# EAGLE design msp430f5528 (EAGLE 5.11)
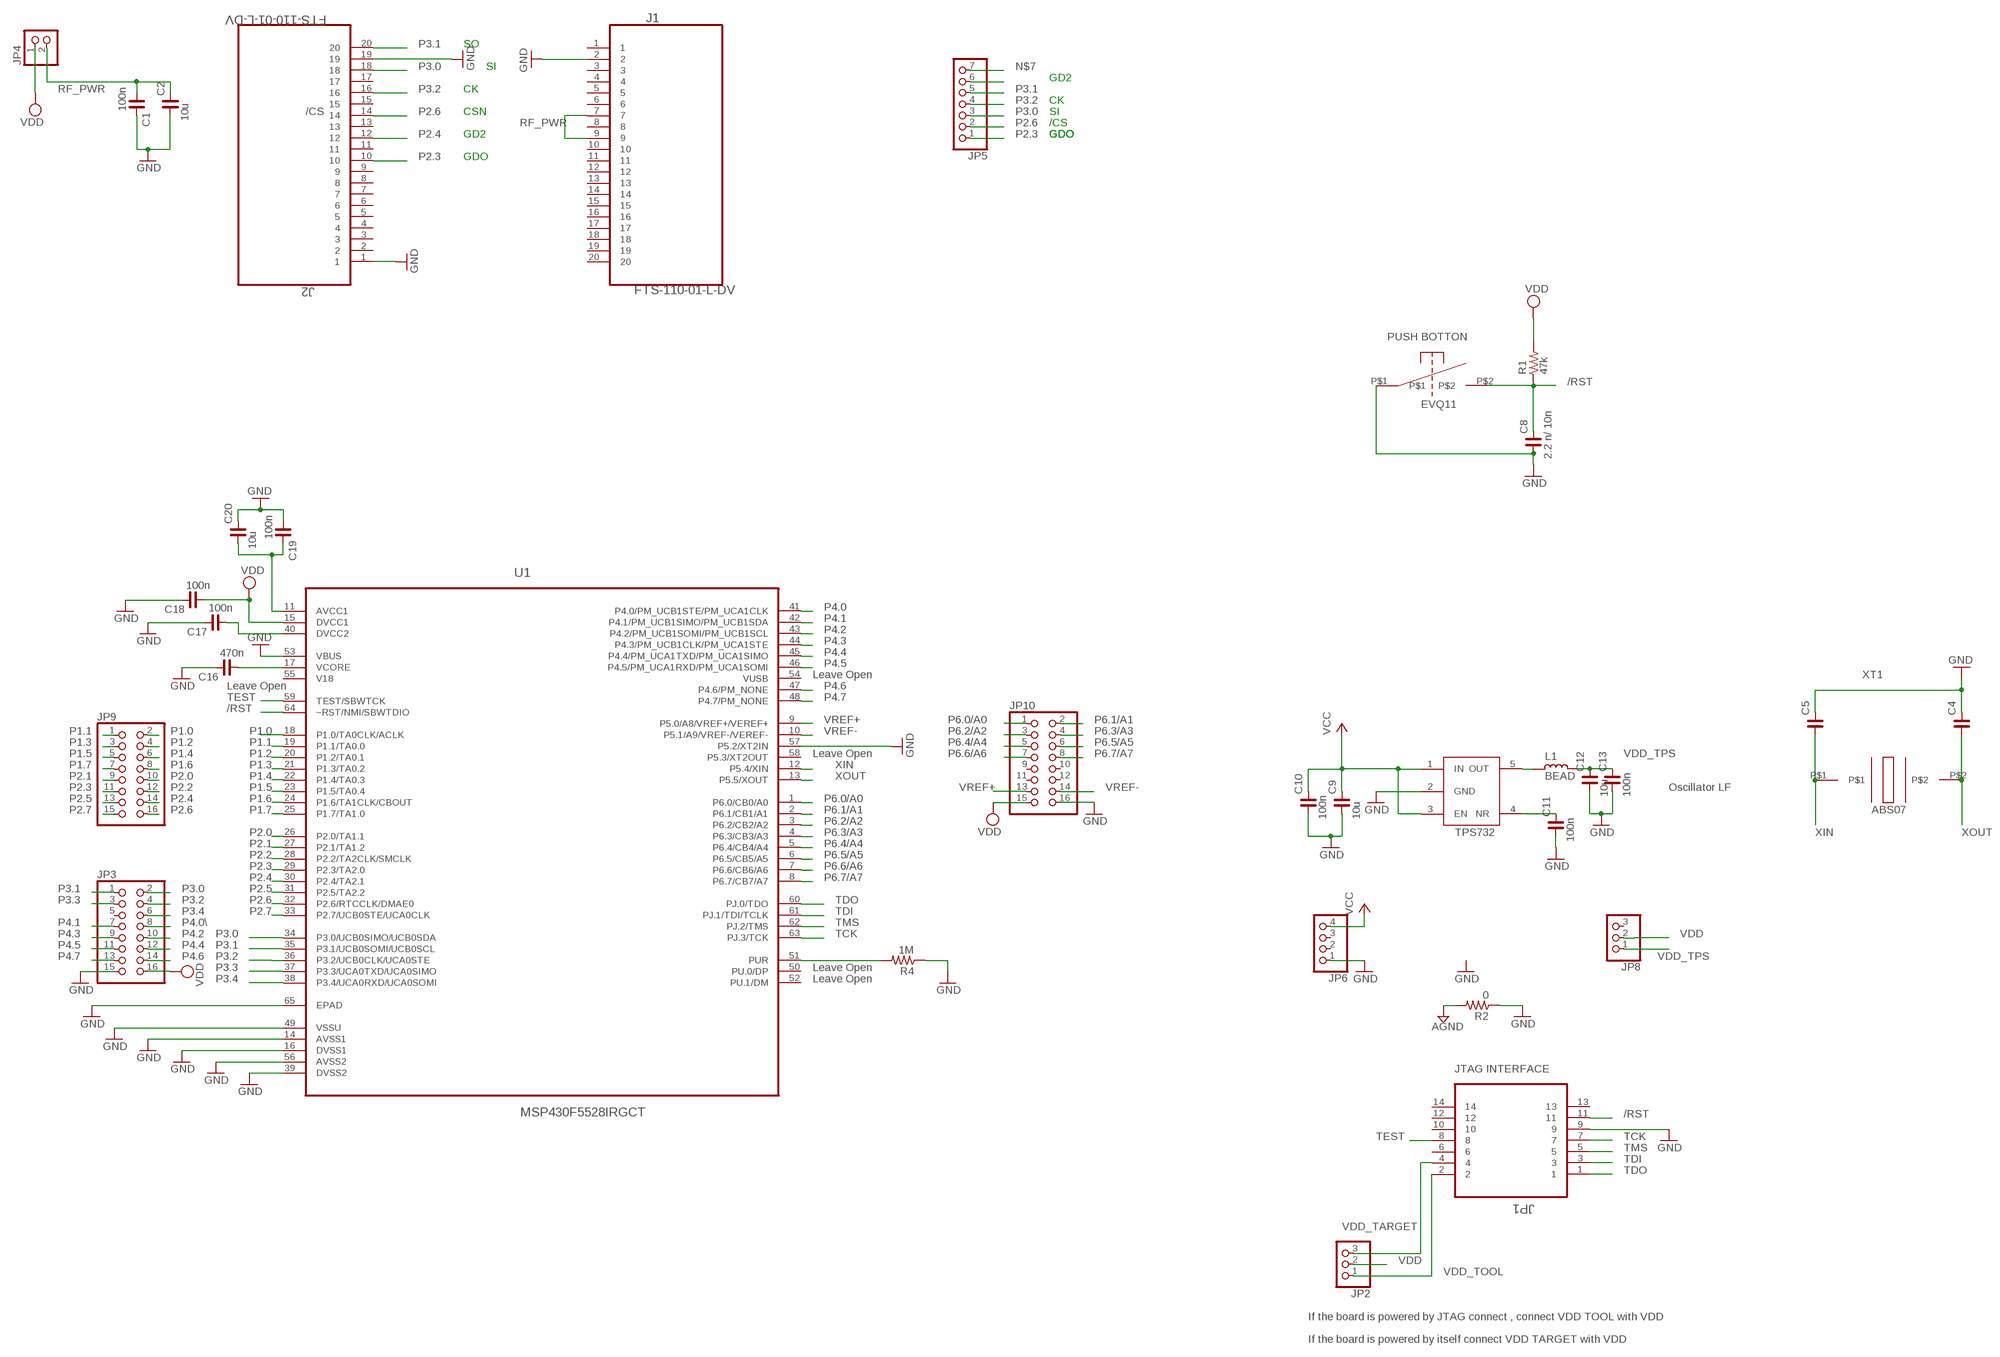
[diagram p0: schematic, sheet 1]

## Parts
C1  100n  C_0402  [C0402]
C2  10u  C_0402  [C0402]
C4  C_0402  [C0402]
C5  C_0402  [C0402]
C8  2.2 n/ 10n  C_0402  [C0402]
C9  10u  C_0402  [C0402]
C10  100n  C_0402  [C0402]
C11  100n  C_0402  [C0402]
C12  10u  C_0402  [C0402]
C13  100n  C_0402  [C0402]
C16  470n  C_0402  [C0402]
C17  100n  C_0402  [C0402]
C18  100n  C_0402  [C0402]
C19  100n  C_0402  [C0402]
C20  10u  C_0402  [C0402]
J1  FTS-110-01-L-DV  [SAMTEC_FTS-110-01-L-DV]
J2  FTS-110-01-L-DV  [SAMTEC_FTS-110-01-L-DV]
JP1  5103308-2  [TYCO_5103308-2]
JP2  PINHD-1X3  [1X03]
JP3  PINHD-2X8  [2X08]
JP4  PINHD-1X2  [1X02]
JP5  PINHD-1X7  [1X07]
JP6  PINHD-1X4  [1X04]
JP8  PINHD-1X3  [1X03]
JP9  PINHD-2X8  [2X08]
JP10  PINHD-2X8  [2X08]
L1  BEAD  L_0402  [L0402]
R1  47k  R_0402  [R0402]
R2  0  R_0402  [R0402]
R4  1M  R_0201  [R0201]
TPS7323  TPS732XX  [SOT23]
U1  MSP430F5528IRGCT  [QFN50P900X900X100-65N]
U$2  OSC32K  [ABS07]
U$4  PUSH_BOT  [EVQ_11_TH]

## Nets
/RST: C8.2 JP1.11 R1.1 U1.64(~RST/NMI/SBWTDIO) U$4.P$2
AGND: R2.2
GND: C1.2 C2.1 C4.2 C5.2 C8.1 C9.1 C10.1 C11.1 C12.1 C13.1 C16.2 C17.2 C18.2 C19.1 C20.2 J1.2 J2.1 J2.19 JP1.9 JP3.15 JP6.1 JP10.16 R2.1 R4.1 TPS7323.2(GND) U1.14(AVSS1) U1.16(DVSS1) U1.39(DVSS2) U1.49(VSSU) U1.53(VBUS) U1.56(AVSS2) U1.57(P5.2/XT2IN) U1.65(EPAD) U$4.P$1
N$6: C16.1 U1.17(VCORE)
N$7: JP5.7
N$8: R4.2 U1.51(PUR)
N$47: C11.2 TPS7323.4(NR)
N$48: L1.2 TPS7323.5(OUT)
P1.0: JP9.2 U1.18(P1.0/TA0CLK/ACLK)
P1.1: JP9.1 U1.19(P1.1/TA0.0)
P1.2: JP9.4 U1.20(P1.2/TA0.1)
P1.3: JP9.3 U1.21(P1.3/TA0.2)
P1.4: JP9.6 U1.22(P1.4/TA0.3)
P1.5: JP9.5 U1.23(P1.5/TA0.4)
P1.6: JP9.8 U1.24(P1.6/TA1CLK/CBOUT)
P1.7: JP9.7 U1.25(P1.7/TA1.0)
P2.0: JP9.10 U1.26(P2.0/TA1.1)
P2.1: JP9.9 U1.27(P2.1/TA1.2)
P2.2: JP9.12 U1.28(P2.2/TA2CLK/SMCLK)
P2.3: J2.10 JP5.1 JP9.11 U1.29(P2.3/TA2.0)
P2.4: J2.12 JP5.6 JP9.14 U1.30(P2.4/TA2.1)
P2.5: JP9.13 U1.31(P2.5/TA2.2)
P2.6: J2.14 JP5.2 JP9.16 U1.32(P2.6/RTCCLK/DMAE0)
P2.7: JP9.15 U1.33(P2.7/UCB0STE/UCA0CLK)
P3.0: J2.18 JP3.2 JP5.3 U1.34(P3.0/UCB0SIMO/UCB0SDA)
P3.1: J2.20 JP3.1 JP5.5 U1.35(P3.1/UCB0SOMI/UCB0SCL)
P3.2: J2.16 JP3.4 JP5.4 U1.36(P3.2/UCB0CLK/UCA0STE)
P3.3: JP3.3 U1.37(P3.3/UCA0TXD/UCA0SIMO)
P3.4: JP3.6 U1.38(P3.4/UCA0RXD/UCA0SOMI)
P4.0: U1.41(P4.0/PM_UCB1STE/PM_UCA1CLK)
P4.0\: JP3.8
P4.1: JP3.7 U1.42(P4.1/PM_UCB1SIMO/PM_UCB1SDA)
P4.2: JP3.10 U1.43(P4.2/PM_UCB1SOMI/PM_UCB1SCL)
P4.3: JP3.9 U1.44(P4.3/PM_UCB1CLK/PM_UCA1STE)
P4.4: JP3.12 U1.45(P4.4/PM_UCA1TXD/PM_UCA1SIMO)
P4.5: JP3.11 U1.46(P4.5/PM_UCA1RXD/PM_UCA1SOMI)
P4.6: JP3.14 U1.47(P4.6/PM_NONE)
P4.7: JP3.13 U1.48(P4.7/PM_NONE)
P6.0/A0: JP10.1 U1.1(P6.0/CB0/A0)
P6.1/A1: JP10.2 U1.2(P6.1/CB1/A1)
P6.2/A2: JP10.3 U1.3(P6.2/CB2/A2)
P6.3/A3: JP10.4 U1.4(P6.3/CB3/A3)
P6.4/A4: JP10.5 U1.5(P6.4/CB4/A4)
P6.5/A5: JP10.6 U1.6(P6.5/CB5/A5)
P6.6/A6: JP10.7 U1.7(P6.6/CB6/A6)
P6.7/A7: JP10.8 U1.8(P6.7/CB7/A7)
RF_PWR: C1.1 C2.2 J1.7 J1.9 JP4.2
TCK: JP1.7 U1.63(PJ.3/TCK)
TDI: JP1.3 U1.61(PJ.1/TDI/TCLK)
TDO: JP1.1 U1.60(PJ.0/TDO)
TEST: JP1.8 U1.59(TEST/SBWTCK)
TMS: JP1.5 U1.62(PJ.2/TMS)
VCC: C9.2 C10.2 JP6.4 TPS7323.1(IN) TPS7323.3(EN)
VDD: C17.1 C18.1 C19.2 C20.1 JP2.2 JP3.16 JP4.1 JP8.2 JP10.15 R1.2 U1.11(AVCC1) U1.15(DVCC1) U1.40(DVCC2)
VDD_TARGET: JP1.4 JP2.3
VDD_TOOL: JP1.2 JP2.1
VDD_TPS: C12.2 C13.2 JP8.1 L1.1
VREF+: JP10.13 U1.9(P5.0/A8/VREF+/VEREF+)
VREF-: JP10.14 U1.10(P5.1/A9/VREF-/VEREF-)
XIN: C5.1 U1.12(P5.4/XIN) U$2.P$1
XOUT: C4.1 U1.13(P5.5/XOUT) U$2.P$2
Unconnected: J1.1 J1.3 J1.4 J1.5 J1.6 J1.8 J1.10 J1.11 J1.12 J1.13 J1.14 J1.15 J1.16 J1.17 J1.18 J1.19 J1.20 J2.2 J2.3 J2.4 J2.5 J2.6 J2.7 J2.8 J2.9 J2.11 J2.13 J2.15 J2.17 JP1.6 JP1.10 JP1.12 JP1.13 JP1.14 JP3.5 JP6.2 JP6.3 JP8.3 JP10.9 JP10.10 JP10.11 JP10.12 U1.50(PU.0/DP) U1.52(PU.1/DM) U1.54(VUSB) U1.58(P5.3/XT2OUT)

## Notes on the sheet
- SO
- SI
- GD2
- CK
- CK
- /CS | CSN | SI
- /CS
- GD2 | GDO | GDO
- GDO
- PUSH BOTTON
- Leave Open | XT1
- Leave Open
- Leave Open
- Oscillator LF
- Leave Open
- Leave Open
- JTAG INTERFACE
- If the board is powered by JTAG connect , connect VDD TOOL with VDD
- If the board is powered by itself connect VDD TARGET with VDD

## Power pins joined to a net without a drawn wire
V18: U1.55(V18)

## Library data of the parts
C1 C2 C4 C5 C8-C13 C16-C20 = rc-master-smd:C_: NON-POLARIZED CAP
J1 J2 = Samtec-FTS-110-01-L-DV:FTS-110-01-L-DV; DESCRIPTION: CONN HEADER 20POS DUAL .05" SMD; MPN: FTS-110-01-L-DV; OC_FARNELL: 1667733; OC_NEWARK: 29K8097; SUPPLIER: Samtec
JP1 = TE_CONNECTOR:5103308-2: HEADER, 2.54MM, 14WAY; MPN: 5103308-2; OC_FARNELL: 1772816; OC_NEWARK: 73K2063; PACKAGE: HEADER, 2.54MM, 14WAY; SUPPLIER: Tyco Electronics
JP2 JP8 = pinhead:PINHD-1X3: PIN HEADER
JP3 JP9 JP10 = pinhead:PINHD-2X8: PIN HEADER
JP4 = pinhead:PINHD-1X2: PIN HEADER
JP5 = pinhead:PINHD-1X7: PIN HEADER
JP6 = pinhead:PINHD-1X4: PIN HEADER
L1 = rc-master-smd:L_: INDUCTOR
R1 R2 R4 = rc-master-smd:R_: RESISTOR
TPS7323 = TPS732xx:TPS732XX
U1 = msp430f5528_variant:MSP430F5528IRGCT: MIXED SIGNAL MICROCONTROLLER; MPN: MSP430F5528IRGCT; OC_FARNELL: 1866820; OC_NEWARK: 74R6475; PACKAGE: VQFN-64; SUPPLIER: TEXAS INSTRUMENTS
U$2 = ABS07:OSC32K
U$4 = push_botton:PUSH_BOT

## Board
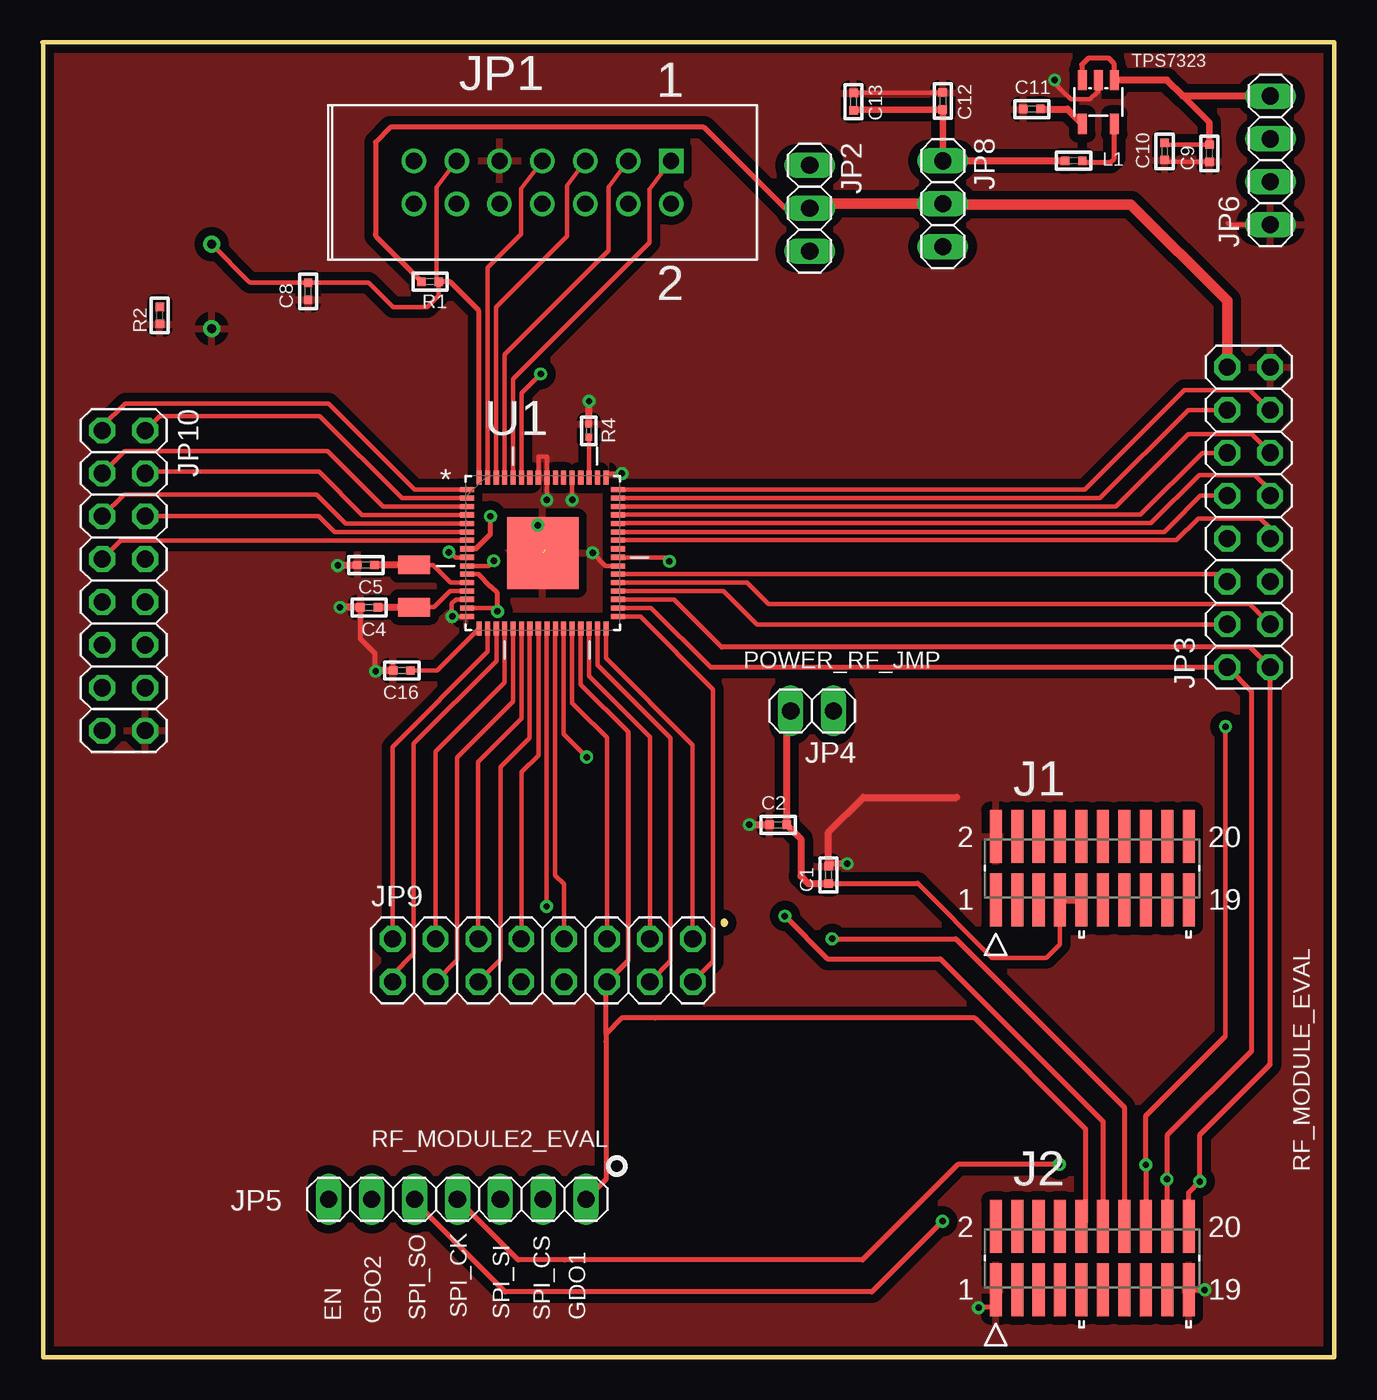
[diagram p1: board, top side]
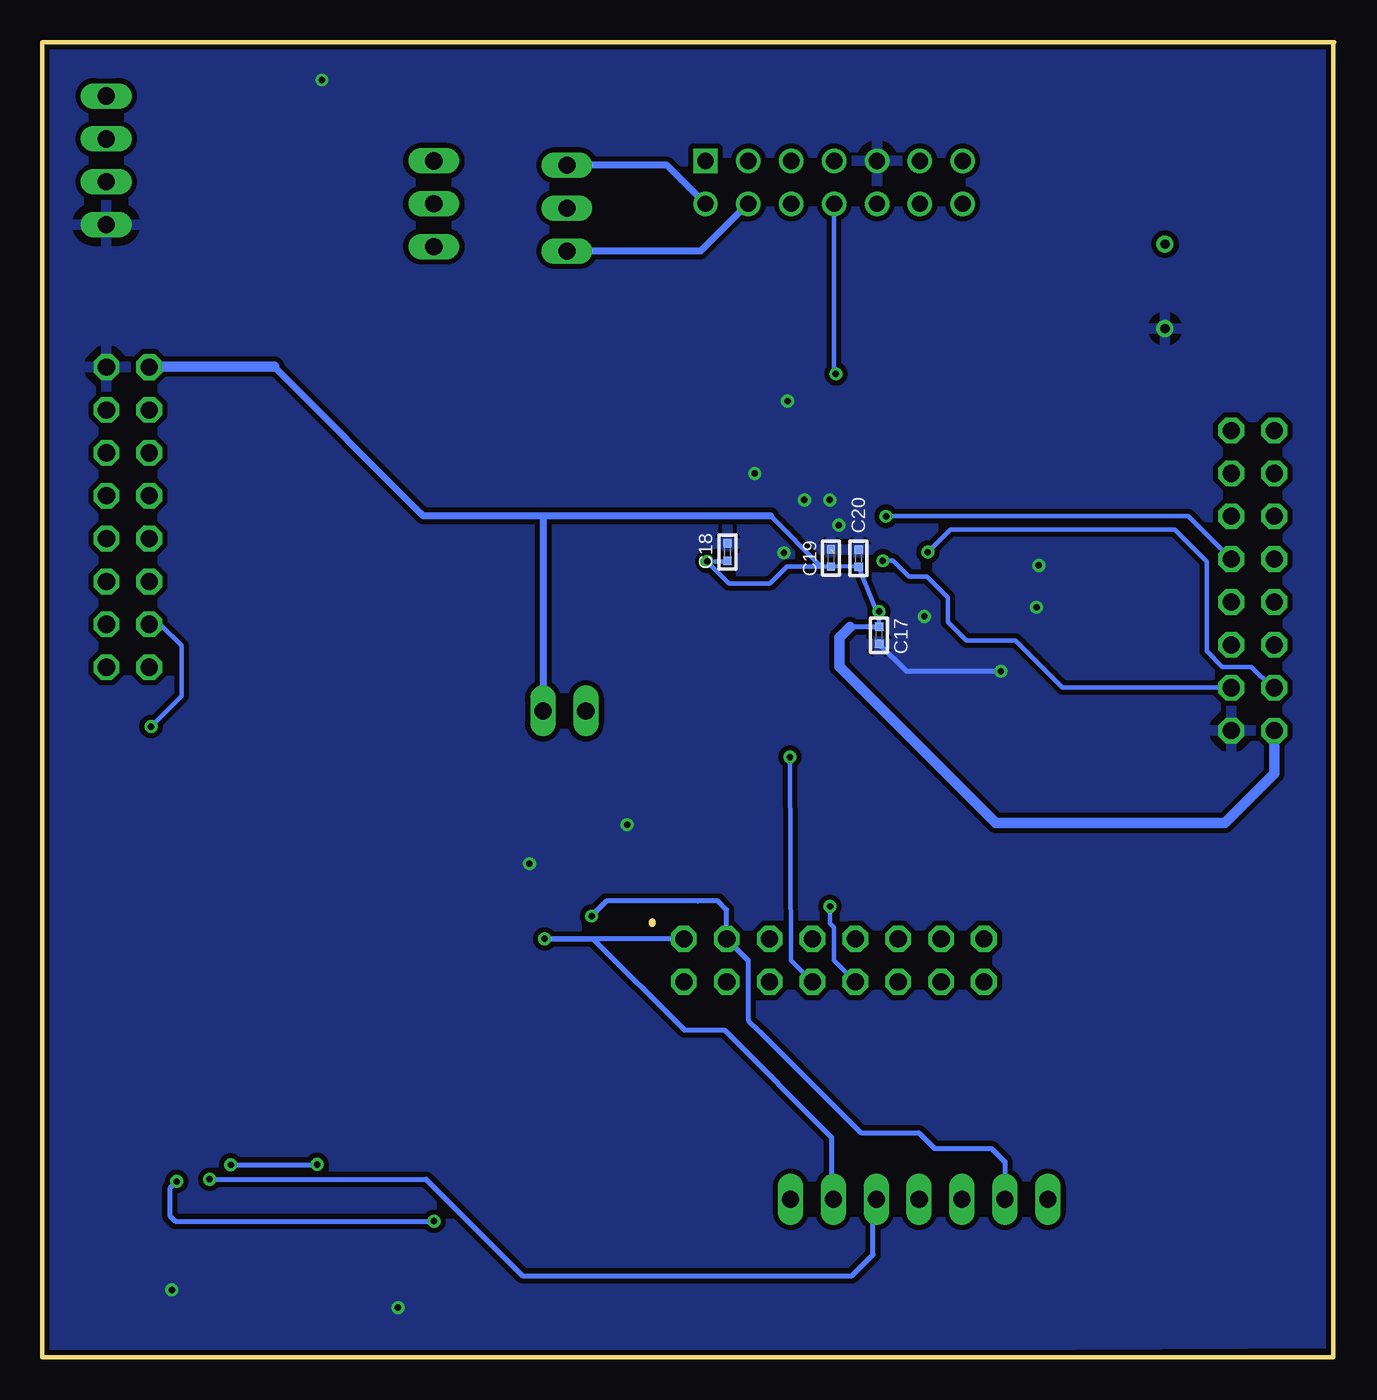
[diagram p2: board, bottom side, seen from below]

Size 76.55 x 77.91 mm. Coordinates in mm from the lower left corner, seen from the top.
Outline: 0,77.91 76.55,77.91 76.55,0 0.05,0 0.05,77.85
Outline: 40.42,25.8 40.42,25.7
Copper layers (1*16): Top 0.035mm / dielectric 1.5mm / Bottom 0.035mm
Design rules "default *": minimum track width 5mil, minimum drill 15mil, track to track 6mil, track to pad 6mil, pad to pad 6mil, via to via 6mil, smd to smd 0mil, copper to edge 6mil, drill to drill 6mil, minimum pad ring 7.5mil, minimum via ring 7.5mil, stop-mask expansion 4mil, vias tented up to drill 15mil, thermal gap 20mil

### Footprints (pad centres in the part's own frame; a part is rotated, then mirrored left to right if it is on the bottom)
C0402 = smd 0.5 x 0.5: 1 -0.508,0; 2 0.508,0
SAMTEC_FTS-110-01-L-DV = smd 0.711 x 3.124: 1 -5.715,-1.88; 2 -5.715,1.88; 3 -4.445,-1.88; 4 -4.445,1.88; 5 -3.175,-1.88; 6 -3.175,1.88; 7 -1.905,-1.88; 8 -1.905,1.88; 9 -0.635,-1.88; 10 -0.635,1.88; 11 0.635,-1.88; 12 0.635,1.88; 13 1.905,-1.88; 14 1.905,1.88; 15 3.175,-1.88; 16 3.175,1.88; 17 4.445,-1.88; 18 4.445,1.88; 19 5.715,-1.88; 20 5.715,1.88
TYCO_5103308-2 = drill 0.965 square: 1 0,2.54 | drill 0.965 round: 2 0,0; 3 -2.54,2.54; 4 -2.54,0; 5 -5.08,2.54; 6 -5.08,0; 7 -7.62,2.54; 8 -7.62,0; 9 -10.16,2.54; 10 -10.16,0; 11 -12.7,2.54; 12 -12.7,0; 13 -15.24,2.54; 14 -15.24,0
1X03 = drill 1.016 long: 1 -2.54,0; 2 0,0; 3 2.54,0
2X08 = drill 1.016 octagon: 1 -8.89,-1.27; 2 -8.89,1.27; 3 -6.35,-1.27; 4 -6.35,1.27; 5 -3.81,-1.27; 6 -3.81,1.27; 7 -1.27,-1.27; 8 -1.27,1.27; 9 1.27,-1.27; 10 1.27,1.27; 11 3.81,-1.27; 12 3.81,1.27; 13 6.35,-1.27; 14 6.35,1.27; 15 8.89,-1.27; 16 8.89,1.27
1X02 = drill 1.016 long: 1 -1.27,0; 2 1.27,0
1X07 = drill 1.016 long: 1 -7.62,0; 2 -5.08,0; 3 -2.54,0; 4 0,0; 5 2.54,0; 6 5.08,0; 7 7.62,0
1X04 = drill 1.016 long: 1 -3.81,0; 2 -1.27,0; 3 1.27,0; 4 3.81,0
L0402 = smd 0.5 x 0.5: 1 -0.508,0; 2 0.508,0
R0402 = smd 0.5 x 0.5: 1 -0.508,0; 2 0.508,0
R0201 = smd 0.4 x 0.4: 1 -0.381,0; 2 0.381,0
SOT23 = smd 0.55 x 1.2: 1 -0.95,-1.3; 2 0,-1.3; 3 0.95,-1.3; 4 0.95,1.3; 5 -0.95,1.3
QFN50P900X900X100-65N = smd 0.813 x 0.305: 1 -4.47,3.759; 2 -4.47,3.251; 3 -4.47,2.743; 4 -4.47,2.261; 5 -4.47,1.753; 6 -4.47,1.245; 7 -4.47,0.762; 8 -4.47,0.254; 9 -4.47,-0.254; 10 -4.47,-0.762; 11 -4.47,-1.245; 12 -4.47,-1.753; 13 -4.47,-2.261; 14 -4.47,-2.743; 15 -4.47,-3.251; 16 -4.47,-3.759; 33 4.47,-3.759; 34 4.47,-3.251; 35 4.47,-2.743; 36 4.47,-2.261; 37 4.47,-1.753; 38 4.47,-1.245; 39 4.47,-0.762; 40 4.47,-0.254; 41 4.47,0.254; 42 4.47,0.762; 43 4.47,1.245; 44 4.47,1.753; 45 4.47,2.261; 46 4.47,2.743; 47 4.47,3.251; 48 4.47,3.759 | smd 0.305 x 0.813: 17 -3.759,-4.47; 18 -3.251,-4.47; 19 -2.743,-4.47; 20 -2.261,-4.47; 21 -1.753,-4.47; 22 -1.245,-4.47; 23 -0.762,-4.47; 24 -0.254,-4.47; 25 0.254,-4.47; 26 0.762,-4.47; 27 1.245,-4.47; 28 1.753,-4.47; 29 2.261,-4.47; 30 2.743,-4.47; 31 3.251,-4.47; 32 3.759,-4.47; 49 3.759,4.47; 50 3.251,4.47; 51 2.743,4.47; 52 2.261,4.47; 53 1.753,4.47; 54 1.245,4.47; 55 0.762,4.47; 56 0.254,4.47; 57 -0.254,4.47; 58 -0.762,4.47; 59 -1.245,4.47; 60 -1.753,4.47; 61 -2.261,4.47; 62 -2.743,4.47; 63 -3.251,4.47; 64 -3.759,4.47 | smd 4.242 x 4.242: 65 0,0
ABS07 = smd 1.1 x 1.9: P$1 -1.25,0; P$2 1.25,0
EVQ_11_TH = drill 0.55 pad 1.016 round: P$1 -2.5,0; P$2 2.5,0

### Placement (x,y rotation side)
C1  46.58,28.58 90 top
C2  43.6,31.54 0 top
C4  19.37,44.42 180 top
C5  19.18,46.93 180 top
C8  15.76,63.15 90 top
C9  69.15,71.33 90 top
C10  66.49,71.44 90 top
C11  58.62,73.94 0 top
C12  53.35,74.42 270 top
C13  48.07,74.38 270 top
C16  21.3,40.69 180 top
C17  26.97,42.77 270 bottom
C18  35.95,47.7 90 bottom
C19  29.82,47.35 270 bottom
C20  28.19,47.34 90 bottom
J1  62.2,28.98 0 top
J2  62.2,5.88 0 top
JP1  37.25,68.34 0 top
JP2  45.46,68.08 270 top
JP3  71.47,49.77 90 top
JP4  45.61,38.29 180 top
JP5  24.6,9.36 180 top
JP6  72.76,70.91 90 top
JP8  53.35,68.34 270 top
JP9  29.65,23.52 0 top
JP10  4.83,46.02 270 top
L1  61.11,70.88 0 top
R1  22.98,63.71 180 top
R2  6.97,61.72 90 top
R4  32.38,54.9 270 top
TPS7323  62.56,74.36 180 top
U1  29.65,47.65 0 top
U$2  22.04,45.69 270 top
U$4  10.03,63.44 90 top

### Tracks (layer width: path | path; a pad name or v marks a point on that pad's centre or on a via)
/RST
  Top 0.254: JP1.11 23.36,69.3 23.36,66.15 23.36,63.98 arc45 23.44,63.8 R1.1 23.49,62.89 22.8,62.2 20.79,62.2 19.34,63.65 15.77,63.65 C8.2 12.42,63.66 arc-45 12.24,63.73 U$4.P$2
  Top 0.305: U1.64 25.87,52.14 25.87,60.74 25.87,62 24.27,63.6 24.15,63.71 R1.1
GND  (via drill 0.38 pad 0.38, 0.38 pad 0.76)  (1 unrouted)
  Top 0.254: v29.89,50.79 29.9,51.4 U1.56 29.9,53.32 29.87,53.35 29.42,53.35 29.41,53.34 29.41,52.14 U1.57 | v31.4,50.79 31.4,51.43 U1.53 | U1.14 25.19,44.89 | U1.39 33.36,46.88 v32.61,47.66 | v19.75,40.64 19.8,40.69 | U1.14 | 70.24,67.17 arc45 70.42,67.1 JP6.1 | C10.1 66.53,70.89 arc45 66.71,70.82 C9.1 | U1.49 arc-90 33.65,52.36 v34.34,52.36 | C16.2 20.79,41.09 | C13.1 48.11,74.93 C12.1 | U1.14 | U1.16 24.59,43.89 v24.28,43.89 24.25,43.92 24.25,44.64 24.52,44.9 U1.14 | TPS7323.2 62.56,75.02 62.07,74.53 60.93,74.53 60.49,74.96 59.98,75.47 v59.98,75.67
  Top 0.305: J2.19 68.49,4 v68.87,4 | 56.47,4.02 J2.1 56.35,4 56.35,2.96 55.47,2.96 v55.47,2.94 | C4.2 18.86,42.55 19.72,41.69 19.72,40.68 v19.75,40.64
  Top 0.406: TPS7323.2 | C5.2 18.64,46.9 v17.51,46.91 | C4.2 18.83,44.45 v17.65,44.44 | 54.18,33.17 48.64,33.17 46.58,31.12 C1.2 46.76,29.26 v47.69,29.24 | R4.1 32.38,56.21 v32.4,56.64 | v41.89,31.56 42.17,31.54 C2.1 | 19.73,40.68 19.73,40.71 20.81,40.71
  Bottom 0.305: C17.2 25.35,40.64 v19.75,40.64
  other vias: 29.36,49.3
  pour Top (isolate 0.508, rank 2): 0.44,77.51 76.7,78.45 76.36,0.22 0.05,0.53 0.39,77.5
  pour Bottom (isolate 0.305): 0.42,77.52 76.91,78.3 76.29,0.4 0.07,0.82 0.37,77.52
N$1
  pour Top (isolate 5.08): 50.61,11.95 66.87,11.8 66.87,1.6 50.64,1.6 50.64,11.89
N$3
  pour Top (isolate 1.27): 26.02,51.35 33.12,51.35 33.12,44.09 25.95,44.09 25.95,51.35
N$5
  pour Top (isolate 3.81): 23.7,55.05 17.11,55.22 17.11,51.8 23.11,51.77 23.72,55.03
  pour Top (isolate 1.397): 25.66,53.84 34.22,53.82 34.28,51.61 24.47,51.61 24.8,52.37
  pour Top (isolate 1.778): 22.89,42.13 22.9,45.27 24.77,45.28 24.77,42.61 23.67,42.16
  pour Top (isolate 1.27): 18.28,47.91 21.18,47.91 21.18,43.35 18.17,43.31 18.17,47.85 18.58,47.89
  pour Top (isolate 2.54): 20.47,64.66 25.03,64.66 24.96,61.28 20.47,61.33
N$6
  Top 0.254: C16.1 23.4,40.69 U1.17
N$8
  Top 0.254: U1.51 R4.2
N$47
  Top 0.406: TPS7323.4 60.73,73.94 C11.2
N$48
  Top 0.305: L1.2 61.71,70.79 63.29,70.79 63.51,71.01 TPS7323.5
P1.0
  Top 0.254: JP9.2 20.76,36.17 26.4,41.81 U1.18
P1.1
  Top 0.254: JP9.1 20.76,22.67 22.02,23.93 22.02,36.35 26.9,41.24 U1.19
P1.2
  Top 0.254: U1.20 27.38,39.98 23.31,35.9 23.31,24.8 JP9.4
P1.3
  Top 0.254: JP9.3 24.59,23.54 24.59,31.88 24.59,35.54 27.9,38.85 U1.21
P1.4
  Top 0.254: JP9.6 25.84,35.26 28.41,37.84 28.41,43.16 U1.22
P1.5
  Top 0.254: JP9.5 27.17,23.58 27.17,34.98 28.88,36.7 U1.23
P1.6
  Top 0.254: JP9.8 28.41,24.82 28.41,34.66 29.39,35.64 U1.24
P1.7  (via drill 0.38 pad 0.38)
  Top 0.254: U1.25 29.86,43.14 v29.88,26.71
  Bottom 0.254: JP9.7 29.65,23.52 29.65,25.47 29.88,25.7 v29.88,26.71
P2.0
  Top 0.254: U1.26 30.4,43.16 30.4,28.56 30.92,28.04 JP9.10
P2.1  (via drill 0.38 pad 0.76)
  Top 0.254: U1.27 30.89,38.32 30.89,36.92 v32.25,35.56
  Bottom 0.254: JP9.9 32.18,23.51 v32.25,35.56
P2.2
  Top 0.254: JP9.12 33.46,36.71 31.75,38.42 31.4,38.77 U1.28
P2.3
  Top 0.254: 34.73,37.04 31.91,39.86 U1.29
  Top 0.305: 34.73,37.04 34.73,23.52 JP9.11 33.39,22.18 33.39,19.17 | J2.10 61.81,8.01 61.81,8.37 61.81,13.53 55.24,20.09 36.31,20.09 34.32,20.09 33.39,19.17 | JP5.1 33.39,10.54 33.39,18.71 33.39,19.17
P2.4  (via drill 0.38 pad 0.38)
  Top 0.254: JP9.14 36,36.75 32.85,39.9 32.39,40.36 U1.30
  Top 0.305: J2.12 62.84,13.98 53.21,23.61 46.52,23.61 v44,26.13
  Bottom 0.305: v44,26.13 43.1,27.03 37.7,27.03 36.52,27.03 36,26.51 JP9.14 34.73,23.51 34.73,22.62 34.73,19.97 34.06,19.31 28.05,13.3 24.61,13.3 23.69,12.37 20.31,12.37 19.52,11.58 JP5.6
P2.5
  Top 0.254: JP9.13 37.23,23.48 37.23,36.69 32.9,41.02 U1.31
P2.6  (via drill 0.38 pad 0.38)
  Top 0.254: U1.32 33.4,41.41 38.54,36.28 JP9.16
  Top 0.305: J2.14 64.11,14.79 54.12,24.79 54.11,24.79 v46.79,24.79
  Bottom 0.254: JP9.16
  Bottom 0.305: JP9.16 v46.78,24.79 v46.79,24.79 43.92,24.79 38.51,19.38 36.12,19.38 29.78,13.04 29.78,9.46 JP5.2
P2.7
  Top 0.254: JP9.15 39.74,23.45 39.74,38.31 39.74,39.57 35.43,43.88 U1.33
P3.0  (via drill 0.38 pad 0.38)
  Top 0.254: U1.34 36.08,44.39 39.59,40.88 | 66.63,7.78 J2.18
  Top 0.305: 39.59,40.88 JP3.2 71.63,39.45 71.63,18.14 66.63,13.14 v66.63,10.55 | v66.63,10.55 66.63,10.26 | 66.63,10.26 66.63,7.78 | v66.63,10.55 66.63,10.26
  Bottom 0.305: JP5.3 27.33,9.17 27.33,6.08 28.56,4.84 48.08,4.84 53.79,10.55 v66.63,10.55
P3.1  (via drill 0.38 pad 0.38)
  Top 0.254: 40.25,42.07 37.42,44.9 U1.35 | J2.20 68.11,7.96
  Top 0.305: 40.25,42.07 71.55,42.07 JP3.1 72.74,17.35 | JP5.5 22.06,9.24 27.42,3.88 49.15,3.88 v53.33,8.06 | 72.74,17.35 72.68,17.35 | J2.20 67.92,9.76 v68.58,10.42 68.58,13.18 72.74,17.35
  Bottom 0.305: v53.33,8.06 68.66,8.06 68.99,8.39 68.99,10.01 v68.58,10.42
P3.2  (via drill 0.38 pad 0.38, 0.38 pad 0.76)
  Top 0.254: U1.36 40.37,45.39 42.35,43.42 JP3.4 | 70.09,19 70.09,37.35 v70.1,37.36
  Top 0.305: v65.38,11.4 J2.16 | v65.38,11.4 65.38,11.57 | 65.38,11.57 65.38,14.29 70.09,19 | 24.79,9.17 JP5.4 28.2,5.76 30.97,5.76 48.59,5.76 54.26,11.43 v60.26,11.43 | v65.38,11.4 65.38,11.57
  Bottom 0.254: v70.1,37.36 68.3,39.17 68.3,42.17 69.55,43.42 JP3.4
  Bottom 0.305: v60.26,11.43 60.28,11.4 v65.38,11.4
P3.3
  Top 0.254: JP3.3 71.55,44.62 43.01,44.62 41.74,45.89 U1.37
P3.4
  Top 0.254: JP3.6 69.76,46.4 U1.38
P4.1
  Top 0.254: U1.42 67.19,48.4 68.49,49.7 72.17,49.7 72.74,49.13 JP3.7
P4.2
  Top 0.254: JP3.10 68.62,51.04 66.83,49.25 66.47,48.89 U1.43
P4.3
  Top 0.254: U1.44 34.13,49.41 65.69,49.41 68.54,52.27 71.84,52.27 72.74,51.37 JP3.9
P4.4
  Top 0.254: U1.45 65.04,49.91 68.71,53.58 JP3.12
P4.5
  Top 0.254: JP3.11 71.64,54.68 67.89,54.68 63.6,50.39 U1.46
P4.6
  Top 0.254: U1.47 62.66,50.89 67.89,56.12 JP3.14
P4.7
  Top 0.254: U1.48 61.76,51.41 67.66,57.31 70.7,57.31 71.55,57.31 JP3.13
P6.0/A0
  Top 0.254: U1.1 22.07,51.41 16.97,56.51 4.92,56.51 3.56,55.16 JP10.1
P6.1/A1
  Top 0.254: JP10.2 6.96,55.76 16.45,55.76 21.31,50.9 U1.2
P6.2/A2
  Top 0.254: JP10.3 4.87,53.68 16.91,53.68 20.19,50.39 U1.3
P6.3/A3
  Top 0.254: U1.4 18.96,49.91 16.39,52.47 6.21,52.47 JP10.4
P6.4/A4
  Top 0.254: JP10.5 4.85,51.11 16.26,51.11 17.97,49.4 U1.5
P6.5/A5
  Top 0.254: U1.6 25.16,48.87 17.32,48.87 16.37,49.83 JP10.6
P6.6/A6
  Top 0.254: U1.7 25.16,48.39 17.54,48.39 | 17.54,48.39 16.81,48.39 | JP10.7 4.66,48.39 17.54,48.39
P6.7/A7  (via drill 0.38 pad 0.38)
  Top 0.254: U1.8 25.19,47.91
  Top 0.305: 25.19,47.91 25.71,47.91 26.32,48.52 26.56,48.76 v26.56,49.82
  Bottom 0.254: v26.56,49.82 24.15,49.84 8.65,49.84 JP10.8
RF_PWR
  Top 0.254: 51.86,28.07 56.27,23.66 59.5,23.66 60.3,24.47 J1.7 | J1.9 61.59,27.08
  Top 0.305: 51.86,28.07 46.05,28.07 46.05,28.05
  Top 0.4: J1.7 J1.9
  Top 0.406: C1.1 | C1.1 46.56,28.05 46.05,28.05 | 44.07,38.3 JP4.2 44.11,38.07 C2.2 44.94,30.72 44.94,28.5 45.37,28.07 C1.1
TCK
  Top 0.254: U1.63 26.39,64.56 28.35,66.52 28.35,69.21 JP1.7
TDI
  Top 0.254: U1.61 27.38,59.41 33.54,65.57 33.54,69.32 JP1.3
TDO
  Top 0.254: U1.60 27.89,57.95 35.97,66.03 35.97,69.21 JP1.1
TEST  (via drill 0.38 pad 0.76)
  Top 0.254: U1.59 28.4,57.13 v29.53,58.26
  Bottom 0.254: v29.53,58.26 29.63,58.36 JP1.8
TMS
  Top 0.254: U1.62 26.9,62.21 31.09,66.4 31.09,69.41 JP1.5
VCC
  Top 0.254: C10.2 66.53,71.91 arc45 66.71,71.83 C9.2
  Top 0.305: 61.59,75.64 61.59,76.57 61.96,76.95 63.19,76.95 63.51,76.63 TPS7323.1
  Top 0.381: 67.57,74.73 69.08,73.22 arc-45 69.15,73.04 C9.2
  Top 0.406: 61.59,75.64 TPS7323.3 | 72.75,74.73 67.57,74.73 66.64,75.66 TPS7323.1
  Top 0.61: 72.75,74.73 JP6.4
VDD  (via drill 0.38 pad 0.38, 0.38 pad 0.41)
  Top 0.254: 44.16,68.08 arc-45 43.98,68.15 | U1.15 | 25.85,46.39 25.19,46.39 U1.11 | v37.16,47.15 36.92,47.39 U1.40 | U1.15 26.76,44.39 v26.97,44.18
  Top 0.305: R1.2 19.82,66.36 arc-45 19.74,66.54 19.74,71.99 20.61,72.86 39.2,72.86 43.99,68.08 JP2.2 44.16,68.08 | 25.85,46.39 26.6,45.63 26.97,45.27 v26.97,44.18 26.97,44.83
  Top 0.61: JP2.2 45.72,68.34 JP8.2 53.39,68.29 64.5,68.29 70.2,62.59 JP3.16
  Bottom 0.254: C17.1 v26.97,44.18 27.21,44.42 C20.1 | C20.1 29.78,46.89 C19.2 32.44,46.84 33.44,45.85 35.85,45.85 v37.16,47.15 35.99,47.15 C18.1 | C20.1 30.43,46.89 33.38,49.84
  Bottom 0.305: 28.68,43.28 C17.1
  Bottom 0.406: 33.38,49.84 46.79,49.84 | 46.79,49.84 53.98,49.84 54.12,49.99 62.82,58.68 | JP4.1 46.88,49.84 46.79,49.84
  Bottom 0.61: 62.82,58.68 70.18,58.68 JP3.16 | JP10.15 3.56,34.59 6.5,31.65 20.05,31.65 29.32,40.93 29.32,42.64 28.68,43.28
VDD_TARGET
  Bottom 0.406: JP1.4 34.74,68.34 37.54,65.54 JP2.3
VDD_TOOL
  Bottom 0.406: JP1.2 39.53,70.62 JP2.1
VDD_TPS
  Top 0.254: JP8.1 | C13.2 48.11,73.91
  Top 0.381: JP8.1 C12.2 48.11,73.91
  Top 0.406: L1.1 58.95,70.88 JP8.1
VREF+  (via drill 0.38 pad 0.38)
  Top 0.254: U1.9 24.49,47.39 24.18,47.7 v24.09,47.7
  Bottom 0.254: JP10.13 3.67,39.67 4.91,40.91 6.65,40.91 7.57,41.83 7.57,47.15 9.46,49.04 22.74,49.04 v24.09,47.7
VREF-  (via drill 0.38 pad 0.38)
  Top 0.254: 25.2,46.91 U1.10 26.44,46.88 v26.75,47.19
  Bottom 0.254: JP10.14 16.12,39.67 18.91,42.46 21.79,42.46 22.89,43.56 22.89,45 24.13,46.24 25.2,46.24 26.15,47.19 v26.75,47.19
XIN
  Top 0.254: U1.12 24.2,45.89 23.15,46.94 U$2.P$1
  Top 0.406: C5.1 U$2.P$1
XOUT
  Top 0.254: U$2.P$2 23.22,44.44 24.17,45.39 U1.13
  Top 0.406: U$2.P$2 22.02,44.42 C4.1

### Text on the board
tNames: POWER_RF_JMP | RF_MODULE2_EVAL | RF_MODULE_EVAL | EN | SPI_SO | SPI_CK | SPI_SI | SPI_CS | GDO1 | GDO2